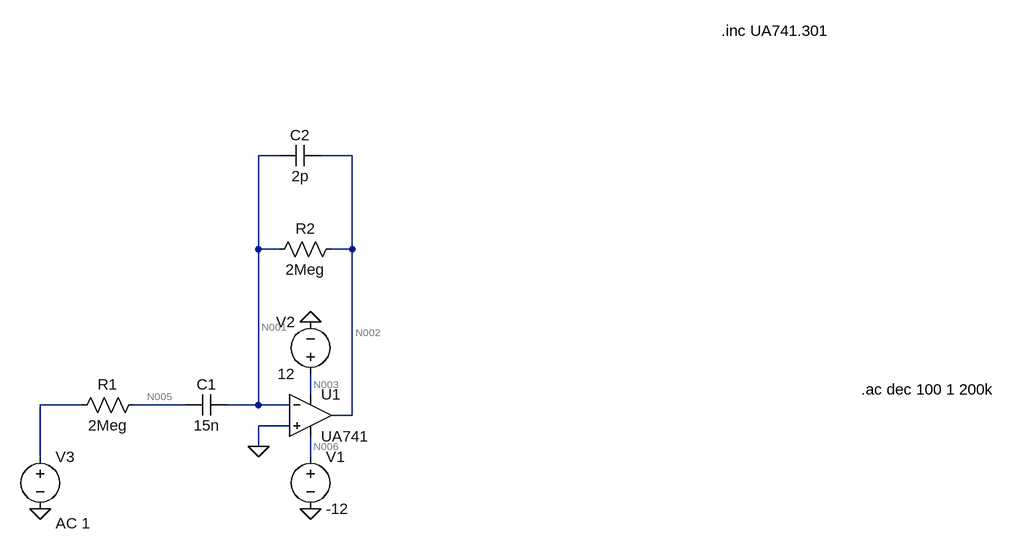
[diagram p0: schematic new_filter.asc]
new_filter.asc, the LTspice schematic file:
Version 4
SHEET 1 880 696
WIRE -368 112 -400 112
WIRE -256 112 -304 112
WIRE -400 256 -400 112
WIRE -368 256 -400 256
WIRE -256 256 -256 112
WIRE -256 256 -288 256
WIRE -320 480 -320 448
WIRE -672 496 -736 496
WIRE -512 496 -592 496
WIRE -400 496 -400 256
WIRE -400 496 -448 496
WIRE -352 496 -400 496
WIRE -256 512 -256 256
WIRE -256 512 -288 512
WIRE -352 528 -400 528
WIRE -400 560 -400 528
WIRE -736 576 -736 496
WIRE -320 576 -320 544
FLAG -400 560 0
FLAG -320 368 0
FLAG -320 656 0
FLAG -736 656 0
SYMBOL OpAmps/opamp2 -320 448 R0
SYMATTR InstName U1
SYMATTR Value UA741
SYMBOL Voltage -320 560 R0
SYMATTR InstName V1
SYMATTR Value -12
SYMBOL Voltage -320 464 R180
WINDOW 0 24 96 Left 2
WINDOW 3 24 16 Left 2
SYMATTR InstName V2
SYMATTR Value 12
SYMBOL Cap -448 480 R90
WINDOW 0 0 32 VBottom 2
WINDOW 3 32 32 VTop 2
SYMATTR InstName C1
SYMATTR Value 15n
SYMBOL Res -576 480 R90
WINDOW 0 0 56 VBottom 2
WINDOW 3 32 56 VTop 2
SYMATTR InstName R1
SYMATTR Value 2Meg
SYMBOL Voltage -736 560 R0
WINDOW 123 24 118 Left 2
SYMATTR Value2 AC 1
SYMATTR InstName V3
SYMATTR Value ""
SYMBOL Res -272 240 R90
WINDOW 0 0 56 VBottom 2
WINDOW 3 32 56 VTop 2
SYMATTR InstName R2
SYMATTR Value 2Meg
SYMBOL Cap -304 96 R90
WINDOW 0 0 32 VBottom 2
WINDOW 3 32 32 VTop 2
SYMATTR InstName C2
SYMATTR Value 2p
TEXT 312 -80 Left 2 !.inc UA741.301
TEXT 528 472 Left 2 !.ac dec 100 1 200k

The netlist it stands for:
* new_filter.asc
XU1 0 N001 N003 N006 N002 UA741  ; pins In+ In- V+ V- OUT
V1 N006 0 -12
V2 N003 0 12
C1 N001 N005 15n
R1 N005 N004 2Meg
V3 N004 0 AC 1
R2 N002 N001 2Meg
C2 N002 N001 2p
.inc UA741.301
.ac dec 100 1 200k
.backanno
.end

* Results of the author's LTspice run, read from the files saved beside the schematic
* Operating Point, zero values left out:
*   V(n002) = 159.5 mV
*   V(n006) = -12 V
*   V(n003) = 12 V
*   V(n001) = 10.45 µV
*   I(R2) = 79.76 nA
*   I(V1) = 1.335 mA
*   I(V2) = -1.335 mA
*   Ix(u1:1) = 79.74 nA
*   Ix(u1:2) = 79.76 nA
*   Ix(u1:3) = 1.335 mA
*   Ix(u1:4) = -1.335 mA
*   Ix(u1:5) = -79.76 nA
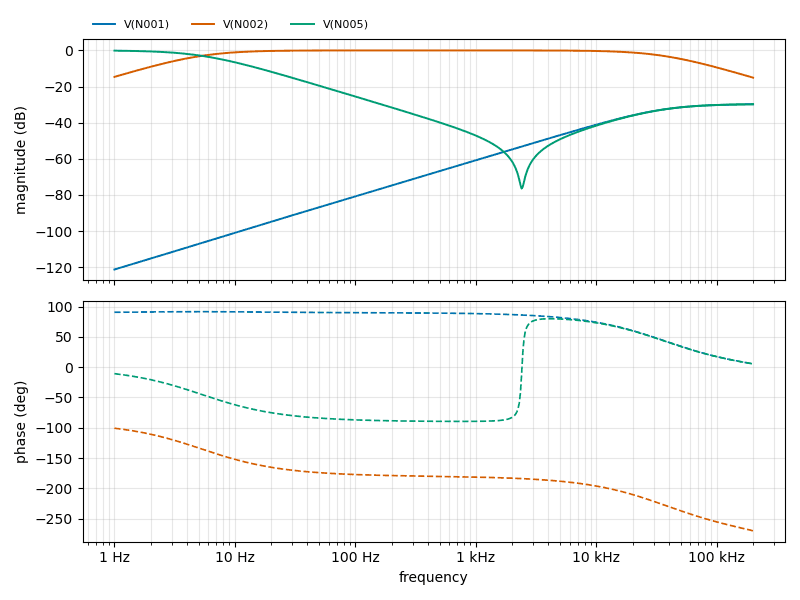
[diagram p1: AC Analysis of new_filter.asc, plotted from the saved traces]
* AC Analysis, 1 run:
*   V(N001): -121.25 dB at 1 Hz, -29.80 dB at 200 kHz, peak -29.80 dB at 200 kHz, 3 dB below the peak at 35.01 kHz
*   V(N002): -14.65 dB at 1 Hz, -15.08 dB at 200 kHz, peak -0.00 dB at 436.5 Hz, 3 dB below the peak at 5.304 Hz and 35.82 kHz
*   V(N005): -0.15 dB at 1 Hz, -29.80 dB at 200 kHz, peak -0.15 dB at 1 Hz, 3 dB below the peak at 5.49 Hz